# EasyEDA Pro project ProPrj_SlimeVR_RelicSkin（fork from SK）.epro, board Relic_Icm45686_9DOF
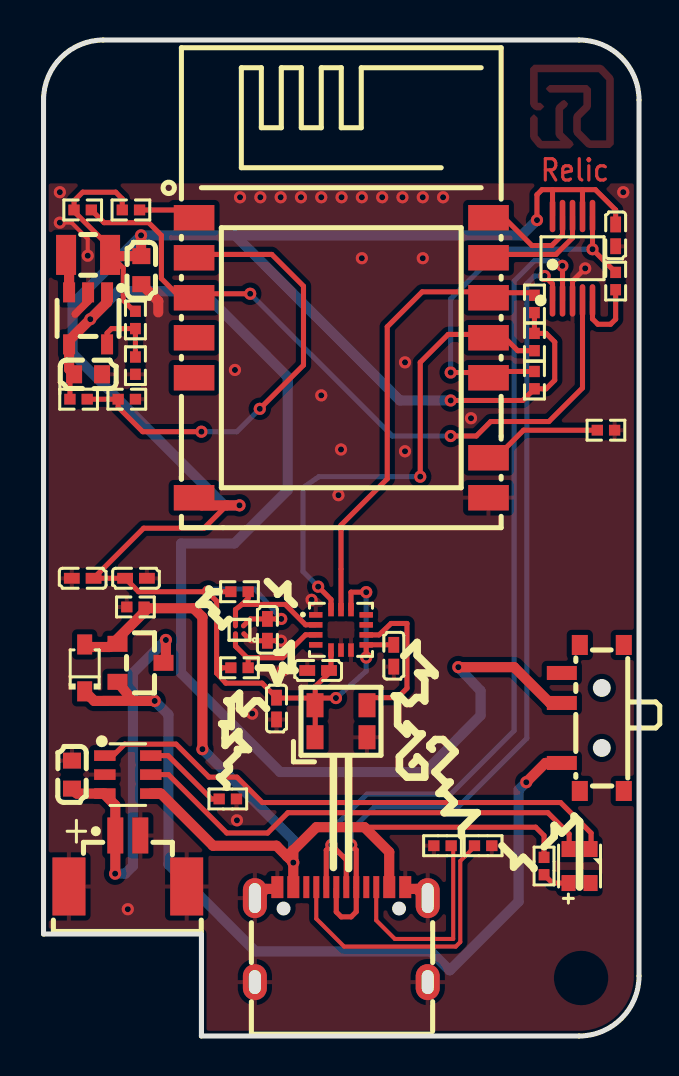
[diagram p5: board, top side]
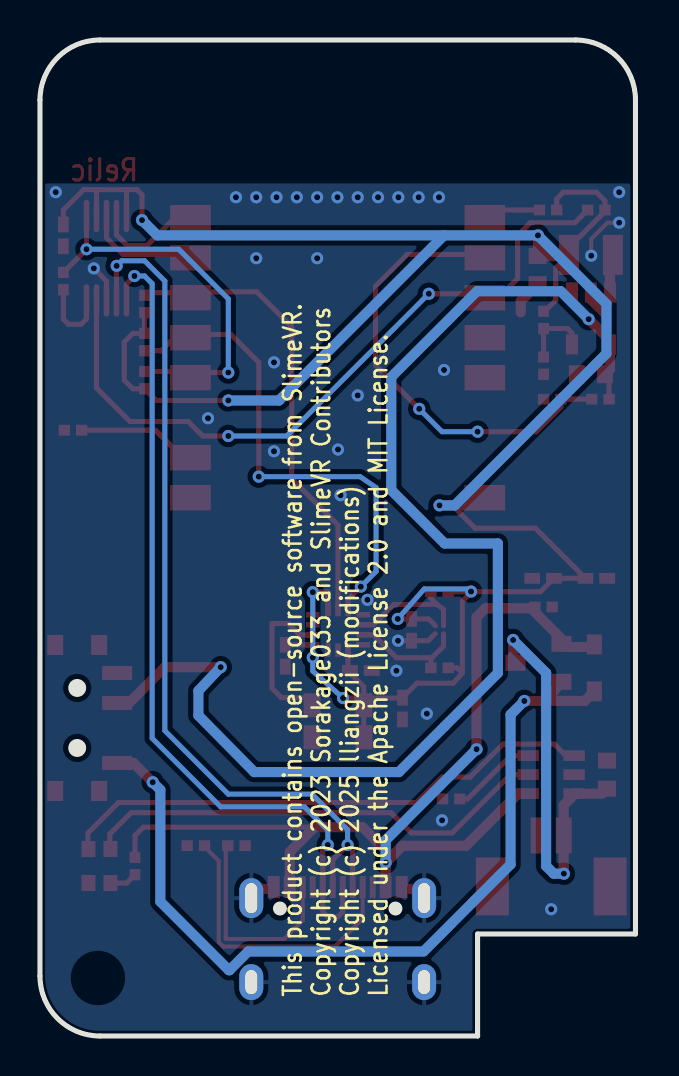
[diagram p6: board, bottom side, seen from below]

Outline 29.8 x 49.8 mm; copper layers: Top Layer, Bottom Layer. Coordinates in mm from the lower left corner of the outline.
Outline path: 0,46.8 arc(0.88,48.92) 3,49.8 26.8,49.8 arc(28.92,48.92) 29.8,46.8 29.8,3 arc(28.92,0.88) 26.8,0 7.9,0 7.9,5.1 0,5.1 0,46.8
Stack: Top Layer 0.035mm / Dielectric1 0.91mm FR4 er 4.5 / Bottom Layer 0.035mm

## Design rules (mm)
spacing Default (default): track to track 0.127, other pairs 0 to 0.127
track width Default (default): min 0.127, default 0.127, max 25.4
differential pair differentialPair (default): width min 0.127, default 0.254, max 2.54; gap min 0.152, default 0.152
via Default (default): diameter min 0.61, default 0.61, max 100.025; hole min 0.305, default 0.305, max 59.995
net GND uses gge20888(1)

## Placement (name value [footprint] x y rotation side)
C1  10uF  [C0402]  1.96 22.89 0 top
C2  10uF  [C0402]  4.63 22.89 180 top
C3  100nF  [C0402]  28.63 40.03 90 top
C4  10uF  [C0603]  2.23 33.09 180 top
C5  100nF  [C0603]  4.9 38.29 90 top
C6  100nF  [C0402]  13.74 18.28 0 top
C7  100nF  [C0402]  17.53 19.01 270 top
C8  100nF  [C0402]  11.66 16.37 90 top
C9  2.2uF  [C0402]  11.2 20.31 90 top
CN1  1.25-2PWB  [conn-smd_2p-p1.25_dealon_1.25-2pwb]  4.22 8.75 0 top
CP1  10uF  [C0603]  1.42 13.07 270 top
D1  1N5819WS  [SOD-323_L1.8-W1.3-LS2.5-RD]  2.06 18.4 90 top
ESP1  2.4GHz  [wifim-smd_esp-12f-esp8266mod]  14.9 33.26 270 top
FB1  22kΩ  [R0402]  4.6 33.52 90 top
FB2  100kΩ  [R0402]  4.6 35.8 90 top
ICM45686  ICM-45686  [LGA-14_L3.0-W2.5-P0.50-TL]  14.89 20.31 0 top
L1  2.2uH  [IND-SMD_L2.5-W2.0_YXMBL252010P]  2.23 39.06 180 top
LED1  NH-B2020RGBA-HF  [LED-ARRAY-SMD_4P-L2.1-W2.1-TL_NH-B2020RGBA]  26.82 8.5 270 top
OSC1  32.768kHz  [OSC-SMD_4P-L3.2-W2.5-BL_TG-5006CE]  14.89 15.74 0 top
P1  TP4057-42-SOT26-R  [SOT-23-6_L2.9-W1.6-P0.95-LS2.8-BL]  4.22 13.07 270 top
Q1  AO3401A  [SOT-23_L2.9-W1.3-P1.90-LS2.4-BR]  4.85 18.66 180 top
R1  4.7kΩ  [R0402]  1.96 41.3 0 top
R2  4.7kΩ  [R0402]  4.37 41.3 0 top
R3  4.7kΩ  [R0402]  24.57 32.79 90 top
R4  4.7kΩ  [R0402]  24.57 34.7 270 top
R5  4.7kΩ  [R0402]  24.57 36.6 90 top
R8  2kΩ  [R0402]  28.63 37.75 270 top
R9  4.7kΩ  [R0402]  4.6 21.45 0 top
R12  1kΩ  [R0402]  9.81 22.21 0 top
R13  10kΩ  [R0402]  9.81 18.41 0 top
RA1  2kΩ  [R0402]  9.22 11.85 0 top
RD1  5.1kΩ  [R0402]  22 9.51 180 top
RD2  5.1kΩ  [R0402]  19.97 9.51 0 top
RD3  4.7kΩ  [R0402]  28.15 30.29 180 top
RL1  1kΩ  [R0402]  25.05 8.5 90 top
SW1  SSSS811101  [SW-SMD_SSSS811101]  27.49 15.9 90 top
U1  ICM-45686  [SOT-23-5_L3.0-W1.7-P0.95-LS2.8-BR]  2.23 35.88 90 top
U2  M3406-ADJ  [X1-WLB0808-4_L0.8-W0.8-P0.40-TL]  9.81 20.31 180 top
UART1  CH340X  [MSOP-10_L3.0-W3.0-P0.50-LS5.0-BL]  26.47 38.89 0 top
USB1  TYPE-C 16PIN 2MD(073)  [USB-C-SMD_TYPE-C-6PIN-2MD-073]  14.9 5.07 0 top
VDG  10kΩ  [R0402]  4.17 31.84 180 top
VDV  47kΩ  [R0402]  1.75 31.84 180 top

## Footprints (pads in the part's own frame, mm; a bottom-side part is the same pattern mirrored in y, then rotated)
C0402
  rect 0.79x0.54 smd: 1(-0.545,0) 2(0.545,0)
C0603
  rect 0.8x0.9 smd: 1(-0.7,0) 2(0.7,0)
conn-smd_2p-p1.25_dealon_1.25-2pwb
  rect 0.8x1.8 smd: 1(-0.625,1.275) 2(0.625,1.275)
  rect 1.651x2.9 smd: 3(-2.946,-1.275) 4(2.946,-1.275)
IND-SMD_L2.5-W2.0_YXMBL252010P
  rect 1x2 smd: 1(1.1,0) 2(-1.1,0)
LED-ARRAY-SMD_4P-L2.1-W2.1-TL_NH-B2020RGBA
  rect 0.8x0.7 smd: 1(-0.85,0.55) 2(0.85,0.55) 3(0.85,-0.55) 4(-0.85,-0.55)
LGA-14_L3.0-W2.5-P0.50-TL
  rect 0.675x0.28 smd: 1(-1.262,0.75) 2(-1.262,0.25) 3(-1.262,-0.25) 4(-1.262,-0.75) 8(1.262,-0.75) 9(1.262,-0.25) 10(1.262,0.25) 11(1.262,0.75)
  rect 0.28x0.675 smd: 5(-0.5,-1.012) 6(0,-1.012) 7(0.5,-1.012) 12(0.5,1.012) 13(0,1.012) 14(-0.5,1.012)
MSOP-10_L3.0-W3.0-P0.50-LS5.0-BL
  oval 0.28x1.62 smd: 1(-1,-2.11) 2(-0.5,-2.11) 3(0,-2.11) 4(0.5,-2.11) 5(1,-2.11) 6(1,2.11) 7(0.5,2.11) 8(0,2.11) 9(-0.5,2.11) 10(-1,2.11)
OSC-SMD_4P-L3.2-W2.5-BL_TG-5006CE
  rect 0.85x1.2 smd: 1(-1.3,-0.8) 2(1.3,-0.8) 3(1.3,0.8) 4(-1.3,0.8)
R0402
  rect 0.566x0.54 smd: 1(-0.433,0) 2(0.433,0)
SOD-323_L1.8-W1.3-LS2.5-RD
  rect 1x0.75 smd: 1(-1.173,0) 2(1.173,0)
SOT-23-5_L3.0-W1.7-P0.95-LS2.8-BR
  rect 1x0.6 smd: 1(1.3,-0.95) 2(1.3,0) 3(1.3,0.95) 4(-1.3,0.95) 5(-1.3,-0.95)
SOT-23-6_L2.9-W1.6-P0.95-LS2.8-BL
  rect 0.532x1.072 smd: 1(-0.95,-1.149) 2(0,-1.149) 3(0.95,-1.149) 4(0.95,1.149) 5(0,1.149) 6(-0.95,1.149)
SOT-23_L2.9-W1.3-P1.90-LS2.4-BR
  rect 1x0.8 smd: 1(1.15,-0.95) 2(1.15,0.95) 3(-1.15,0)
SW-SMD_SSSS811101
  rect 0.7x1.5 smd: 1(-2.25,1.55) 2(0.75,1.55) 3(2.25,1.55)
  rect 1x0.8 smd: 4(-3.65,0.65) 5(3.65,0.65) 6(3.65,-1.55) 7(-3.65,-1.55)
USB-C-SMD_TYPE-C-6PIN-2MD-073
  rect 0.6x1.1 smd: 1(-3.2,2.375) 2(-2.4,2.375) 11(2.4,2.375) 12(3.2,2.375)
  rect 0.3x1.1 smd: 3(-1.75,2.375) 4(-1.25,2.375) 5(-0.75,2.375) 6(-0.25,2.375) 7(0.25,2.375) 8(0.75,2.375) 9(1.25,2.375) 10(1.75,2.375)
  oval 1.2x2 hole 0.6x1.5: 13(-4.325,1.825) 14(4.325,1.825)
  oval 1.2x1.8 hole 0.6x1.2: 15(-4.325,-2.375) 16(4.325,-2.375)
wifim-smd_esp-12f-esp8266mod
  rect 1.27x2.032 smd: 1(-7.651,-7.366) 2(-5.651,-7.366) 3(-3.651,-7.366) 4(-1.651,-7.366) 5(0.349,-7.366) 8(6.349,-7.366) 9(6.349,7.366) 10(4.349,7.366) 12(0.349,7.366) 13(-1.651,7.366) 14(-3.651,7.366) 15(-5.651,7.366) 16(-7.651,7.366)
X1-WLB0808-4_L0.8-W0.8-P0.40-TL
  round 0.18 smd: A1(-0.2,0.2) A2(0.2,0.2) B1(-0.2,-0.2) B2(0.2,-0.2)

## Nets
3V3: C1.2 C2.2 C3.2 C5.2 C6.2 C7.1 C8.2 C9.2 ESP1.8 FB2.2 ICM45686.5 ICM45686.8 ICM45686.12 L1.2 OSC1.1 OSC1.4 R1.1 R2.1 R3.1 R4.1 R5.1 R12.1 R13.1 U2.B1 UART1.7 UART1.10
+5V: D1.2 P1.4 Q1.1 R9.2 RL1.2 USB1.2 USB1.11
GND: C1.1 C2.1 C3.1 C4.1 C5.1 C6.1 C7.2 C8.1 C9.1 CN1.2 CN1.3 CN1.4 CP1.1 ESP1.9 FB1.1 ICM45686.1 ICM45686.6 ICM45686.7 OSC1.2 P1.2 R9.1 RA1.2 RD1.1 RD2.1 RD3.1 U1.2 U2.A1 UART1.3 USB1.1 USB1.12 USB1.13 USB1.14 USB1.15 USB1.16 VDG.1
VIN: C4.2 SW1.2 U1.1 U1.4 VDV.2
ADC: ESP1.2 VDG.2 VDV.1
BAT+: CN1.1 CP1.2 P1.3 Q1.3
DN: UART1.2 USB1.5 USB1.7
DP: UART1.1 USB1.6 USB1.8
EN: ESP1.3 R1.2 UART1.4
G: LED1.4 P1.5
GPIO0: ESP1.12 R3.2 R8.1 UART1.6
GPIO15: ESP1.10 RD3.2
INT: ESP1.5
MCLK: ICM45686.9 OSC1.3
R: LED1.1 P1.1
RST: ESP1.1 R2.2
RX: ESP1.15 UART1.8
SCL: ESP1.14 ICM45686.13 R5.2
SCX: ICM45686.3 R13.2 U2.A2
SDA: ESP1.13 ICM45686.14 R4.2
SDX: ICM45686.2 R12.2 U2.B2
TX: ESP1.16 UART1.9
VOUT: D1.1 Q1.2 SW1.1
$1N6016: RD1.2 USB1.4
$1N6017: RD2.2 USB1.10
$1N6024: P1.6 RA1.1
$1N28912: R8.2 UART1.5
$1N31333: L1.1 U1.3
$1N31339: FB1.2 FB2.1 U1.5
$1N32922: LED1.3 RL1.1

Pads without a net: ESP1 4; ICM45686 4 10 11; LED1 2; SW1 3 4 5 6 7; USB1 3 9

## Via types
v1: diameter 0.61, hole 0.305, Top Layer to Bottom Layer, 60 vias

## Routing (per net, layer and track width the routed paths; a pad name or vN(x,y) marks a point on that pad's centre or on a via; arc(x,y) is an arc through that point)
3V3: length 134.2
  Top Layer w0.254: 8.66,18.15 8.92,18.41 R13.1 ; R12.1 8.19,22.21 8.66,21.74 8.66,18.14 9.12,17.64 10.94,17.64 C8.2 ; 10.01,20.51 10.35,20.85 C9.2 v1(11.9,20.85) ; 14.38,18.23 13.6,17.47 13.6,16.9 ; 13.6,16.9 11.65,16.9 ; 13.6,16.9 13.6,15.33 13.59,15.32 ; 13.6,16.9 v1(14.63,16.9) ; 14.39,19.17 14.39,18.23 ; ICM45686.12 15.39,22.19 v1(16.15,22.19) ; v1(16.15,18.92) ICM45686.8 17.4,19.56 ; R2.1 3.94,41.86 3.61,42.19 1.96,42.19 1.53,41.76 R1.1 1.53,41.23 3.33,39.42 L1.2 ; 3.39,38.99 3.99,38.39 3.99,36.78 4.63,36.15 ; 9.17,26.53 8.03,25.39 5.01,25.39 C1.2 C2.2 4.75,22.21 8.16,22.21 ; v1(24.69,40.79) 24.69,42.06 24.95,42.32 27.61,42.32 28.63,41.3 C3.2 ; UART1.10 25.47,42.32 ; R5.1 R4.1 25.15,35.13 25.58,34.7 25.58,32.79 25.15,32.36 R3.1 23.98,31.78 v1(20.38,31.78) ; UART1.7 26.97,42.32
  Top Layer w0.508: v1(9.81,26.53) 7.92,26.53 ESP1.8 ; L1.2 3.39,38.99 C5.2 4.88,39.01 v1(4.88,40.03)
  Bottom Layer w0.254: v1(8.23,22.22) 8.36,22.35 10.57,22.35 v1(11.9,20.85) ; v1(16.15,22.19) v1(16.15,18.92) 16.15,18.25 v1(14.63,16.9)
  Bottom Layer w0.508: 9.58,40.03 17.84,31.78 v1(20.38,31.78) ; 9.58,40.03 23.93,40.03 v1(24.69,40.79) ; 9.58,40.03 v1(4.88,40.03) 1.45,36.6 1.45,34.12 9.04,26.53 v1(9.81,26.53)
+5V: length 49.9
  Top Layer w0.254: RL1.2 25.05,10.02 24.63,10.44 16.06,10.44
  Top Layer w0.508: 12.5,9.3 12.51,9.3 13.65,10.44 16.06,10.44 17.3,9.2 17.3,7.36 ; 12.5,9.3 v1(12.5,8.67) ; 12.5,9.3 12.19,8.98 ; v1(12.5,8.67) 12.19,8.98 ; v1(12.5,8.67) 12.5,7.36 ; 12.19,8.98 11.66,9.51 8.48,9.51 5.88,12.12 P1.4 ; v1(7.95,14.34) 7.95,20.94 7.51,21.39 5.23,21.39 3.29,19.45 2.19,19.45 D1.2
  Bottom Layer w0.508: v1(7.95,14.34) 12.5,9.79 v1(12.5,8.67)
GND: length 12.3
  Top Layer w0.203: v1(0.82,40.67) 1.4,40.67 2.21,39.85 v1(2.21,39.02)
  Top Layer w0.254: 10.03,20.11 10.37,19.76 C9.1 ; 11.08,19.76 11.83,19.76 ; v1(27.11,38.38) 26.47,37.75 UART1.3
  Top Layer w0.381: 1.58,36.09 2.23,36.75 U1.2
  Top Layer w0.508: 10.57,6.81 11.12,7.36 11.7,7.36 ; 18.1,7.36 18.67,7.36 19.22,6.81 ; C5.1 5.74,36.75 5.74,36.18
  vias: v1(0.82,42.19) v1(4.22,6.34) v1(9.58,33.3) v1(9.68,10.78) v1(9.83,41.94) v1(10.44,16.12) v1(10.85,41.94) v1(11.87,41.94) v1(11.88,19.76) v1(11.97,18.26) v1(12.88,41.94) v1(13.41,21.81) v1(13.9,41.94) v1(13.9,32.03) v1(14.76,27.04) v1(14.91,41.94) v1(14.89,29.33) v1(15.93,41.94) v1(15.93,38.89) v1(16.95,41.94) v1(17.96,41.94) v1(18.09,33.68) v1(18.09,29.24) v1(18.98,41.94) v1(18.98,38.89) v1(19.99,41.94) v1(21.39,30.89) v1(29.01,42.19)
VIN: length 64.1
  Top Layer w0.254: C4.2 1.32,32.88 VDV.2
  Top Layer w0.508: U1.1 3.18,36.68 v1(2.34,35.84) 1.28,34.78 U1.4 1.28,33.34 C4.2 ; SW1.2 25.34,16.65 23.55,18.44 v1(20.76,18.44)
  Bottom Layer w0.508: v1(20.76,18.44) 21.87,17.26 21.87,16.03 19.08,13.2 11.84,13.2 6.89,18.15 6.89,24.63 9.55,24.63 12.22,27.3 12.22,32.95 7.93,37.24 3.74,37.24 v1(2.34,35.84)
ADC: length 23.4
  Top Layer w0.254: VDV.1 VDG.2 3.73,31.44 4.96,30.22 v1(7.9,30.22) ; 7.35,39.08 11.42,39.08 13.01,37.49 13.01,33.55 v1(10.82,31.36)
  Bottom Layer w0.254: v1(7.9,30.22) 9.68,30.22 v1(10.82,31.36)
BAT+: length 20.2
  Top Layer w0.508: Q1.3 6.12,18.78 v1(6.12,19.8) ; 3.01,12.12 1.67,12.12 CP1.2 ; 3.01,12.12 P1.3 ; 3.01,12.12 3.59,11.54 CN1.1 3.59,8.13 v1(3.58,8.12)
  Bottom Layer w0.508: v1(6.12,19.8) 4.47,18.15 4.47,8.5 4.09,8.12 v1(3.58,8.12)
DN: length 43.9
  Top Layer w0.254: 14.15,7.36 14.15,9.29 v1(14.41,9.55) 15.15,8.81 15.15,7.36 ; UART1.2 25.97,38.5 v1(25.96,38.51)
  Bottom Layer w0.254: v1(25.96,38.51) 25.71,38.76 24.57,38.76 23.55,37.75 23.55,15.27 20.38,12.09 16.18,12.09 14.41,10.31 v1(14.41,9.55)
DP: length 42.4
  Top Layer w0.254: 14.65,7.36 14.65,6.21 14.9,5.96 15.39,5.96 15.65,6.21 15.65,9.3 v1(15.4,9.55) ; v1(25.07,38) 25.47,37.6 UART1.1
  Bottom Layer w0.254: v1(25.07,38) 24.57,38 24.19,37.62 24.19,14.89 20.76,11.46 16.56,11.46 15.4,10.29 v1(15.4,9.55)
EN: length 35.9
  Top Layer w0.254: v1(20.38,30) 21.66,30 22.38,30.72 25.29,30.72 26.97,32.4 UART1.4 ; v1(10.34,37.11) 7.38,37.11 7.35,37.08 6.69,37.08 5.9,37.87 5.9,40.03 5.26,40.67 3.03,40.67 R1.2
  Bottom Layer w0.254: v1(10.34,37.11) 17.45,30 v1(20.38,30)
G: length 23.7
  Top Layer w0.254: P1.5 6.25,13.07 9.17,10.15 11.21,10.15 12.23,11.17 25.24,11.17 26.3,10.1 26.3,9.39
GPIO0: length 19.4
  Top Layer w0.254: R8.1 v1(27.47,39.34) UART1.6 ; R3.2 22.6,33.23 22.45,33.08 22.36,33.17 v1(20.38,33.17)
  Bottom Layer w0.254: v1(27.47,39.34) 22.86,39.34 20.38,36.86 v1(20.38,33.17)
GPIO15: length 5.9
  Top Layer w0.254: 22.45,29.08 22.48,29.11 22.84,29.11 24.02,30.29 27.84,30.29
R: length 26.8
  Top Layer w0.254: 3.49,14.02 4.06,14.59 6.63,14.59 8.28,12.94 9.68,12.94 10.95,11.67 25.87,11.67 27.4,10.15 27.4,9.39
RST: length 2.6
  Top Layer w0.254: R2.2 7.12,41.3 7.35,41.08
RX: length 5.5
  Top Layer w0.254: UART1.8 26.47,39.91 25.64,39.08 22.45,39.08
SCL: length 23.3
  Top Layer w0.254: 17.2,27.86 14.89,25.54 ICM45686.13 ; R5.2 24.44,37.16 22.49,37.16 22.45,37.21 18.95,37.21 17.2,35.46 17.2,27.85
SDA: length 25.1
  Top Layer w0.254: v1(13.74,22.47) 14.39,21.83 ICM45686.14 ; R4.2 23.73,34.27 22.92,35.08 20.25,35.08 18.85,33.68 v1(18.85,27.97)
  Bottom Layer w0.254: v1(13.74,22.47) 12.98,23.23 12.98,27.42 13.78,27.97 v1(18.85,27.97)
TX: length 5.3
  Top Layer w0.254: 22.45,41.08 22.88,41.08 24.44,39.52 25.43,39.52 25.97,40.06 UART1.9
VOUT: length 42.8
  Top Layer w0.508: v1(5.56,16.75) 4.48,16.75 4.47,16.76 ; D1.1 2.54,16.75 4.47,16.76 ; v1(24.16,12.69) 25.12,13.65 SW1.1 ; 4.47,16.76 Q1.2
  Bottom Layer w0.508: v1(24.16,12.69) 23.78,12.31 23.78,6.72 20.35,3.29 20.32,3.29 19.38,4.23 10.6,4.23 6.25,8.58 6.25,16.07 v1(5.56,16.75)
$1N6016: length 14.5
  Top Layer w0.203: 21.56,9.51 21.56,9.46 20.86,8.75 20.86,4.7 20.63,4.47 15.04,4.47 13.65,5.86 13.65,7.36
$1N6017: length 10.5
  Top Layer w0.203: 20.34,9.51 20.5,9.35 20.5,4.85 17.58,4.85 16.65,5.79 16.65,7.36
$1N6024: length 4.3
  Top Layer w0.254: RA1.1 8.4,11.85 6.23,14.02 P1.6
$1N28912: length 3.8
  Top Layer w0.254: UART1.5 27.47,35.86 27.74,35.59 28.38,35.59 28.63,35.84 R8.2
$1N31333: length 1.9
  Top Layer w0.508: U1.3 1.28,38.91 L1.1
$1N31339: length 3.5
  Top Layer w0.254: FB1.2 FB2.1 3.4,35.37 3.18,35.15 U1.5
$1N32922: length 1.4
  Top Layer w0.254: RL1.1 25.46,7.65 LED1.3
MCLK: length 7.7
  Top Layer w0.254: ICM45686.9 16.15,20.06 16.79,20.06 17.39,20.63 18.19,20.63 18.19,17.39 17.72,16.92 16.19,16.92
SCX: length 5.9
  Top Layer w0.254: U2.A2 9.61,19.49 10.19,18.91 11.97,18.91 13.11,20.06 ICM45686.3 ; R13.2 10.24,18.91
SDX: length 6.1
  Top Layer w0.254: 9.61,20.51 9.61,21.33 9.93,21.58 ; 9.93,21.58 10.24,21.89 R12.2 ; 9.93,21.58 12.09,21.58 13.11,20.56 ICM45686.2

## Copper pours and planes (outline as drawn; the poured copper is in the pictures)
GND on Top Layer: -5.69,57.65 31.78,57.65 31.78,-0.77 -5.69,-0.77
GND on Bottom Layer: -3.15,55.11 31.52,55.11 31.52,-3.44 -3.15,-3.44
(no net) on Top Layer: 24.35,48.57 28.54,48.57 28.54,44.4 24.35,44.4
(no net) on Top Layer: 24.35,46.81 26.53,46.81 26.53,44.38 24.35,44.38

## Text on the board
Bottom Silkscreen Layer: This product contains open-source software from SlimeVR. / Copyright (c) 2023 Sorakage033 and SlimeVR Contributors / Copyright (c) 2025 lliangzii (modifications) / Licensed under the Apache License 2.0 and MIT License.
Document Layer: Y | TP4057:2K | DEG_0
Top Layer: Relic
Top Solder Mask Layer: Z | Y | X | 400mA | 5V | ... | Relic | SECURE YOUR SOUL | Never Fade / Away | -
Top Silkscreen Layer: +
